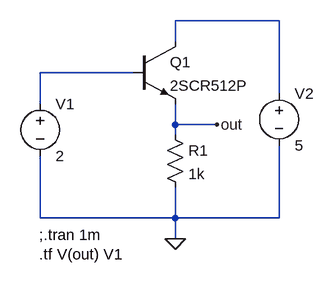
[diagram p0: schematic Emitter Follower (Common Collector Amplifier) Transfer Function.asc]
Emitter Follower (Common Collector Amplifier) Transfer Function.asc, the LTspice schematic file:
Version 4
SHEET 1 880 680
WIRE 416 16 256 16
WIRE 256 48 256 16
WIRE 192 96 48 96
WIRE 416 128 416 16
WIRE 48 144 48 96
WIRE 256 176 256 144
WIRE 320 176 256 176
WIRE 256 192 256 176
WIRE 48 320 48 224
WIRE 256 320 256 272
WIRE 256 320 48 320
WIRE 416 320 416 208
WIRE 416 320 256 320
WIRE 256 352 256 320
FLAG 320 176 out
FLAG 256 352 0
SYMBOL voltage 48 128 R0
WINDOW 123 0 0 Left 0
WINDOW 39 0 0 Left 0
SYMATTR InstName V1
SYMATTR Value 2
SYMBOL voltage 416 112 R0
WINDOW 123 0 0 Left 0
WINDOW 39 0 0 Left 0
SYMATTR InstName V2
SYMATTR Value 5
SYMBOL npn 192 48 R0
SYMATTR InstName Q1
SYMATTR Value 2SCR512P
SYMBOL res 240 176 R0
SYMATTR InstName R1
SYMATTR Value 1k
TEXT 46 346 Left 2 !;.tran 1m
TEXT 46 376 Left 2 !.tf V(out) V1

The netlist it stands for:
* Emitter Follower (Common Collector Amplifier) Transfer Function.asc
V1 N002 0 2
V2 N001 0 5
Q1 N001 N002 out 0 2SCR512P
R1 out 0 1k
.model NPN NPN
.model PNP PNP
.lib standard.bjt
;.tran 1m
.tf V(out) V1
.backanno
.end